# EAGLE design ardunio-physics-board-v4 (EAGLE 9.6.2)
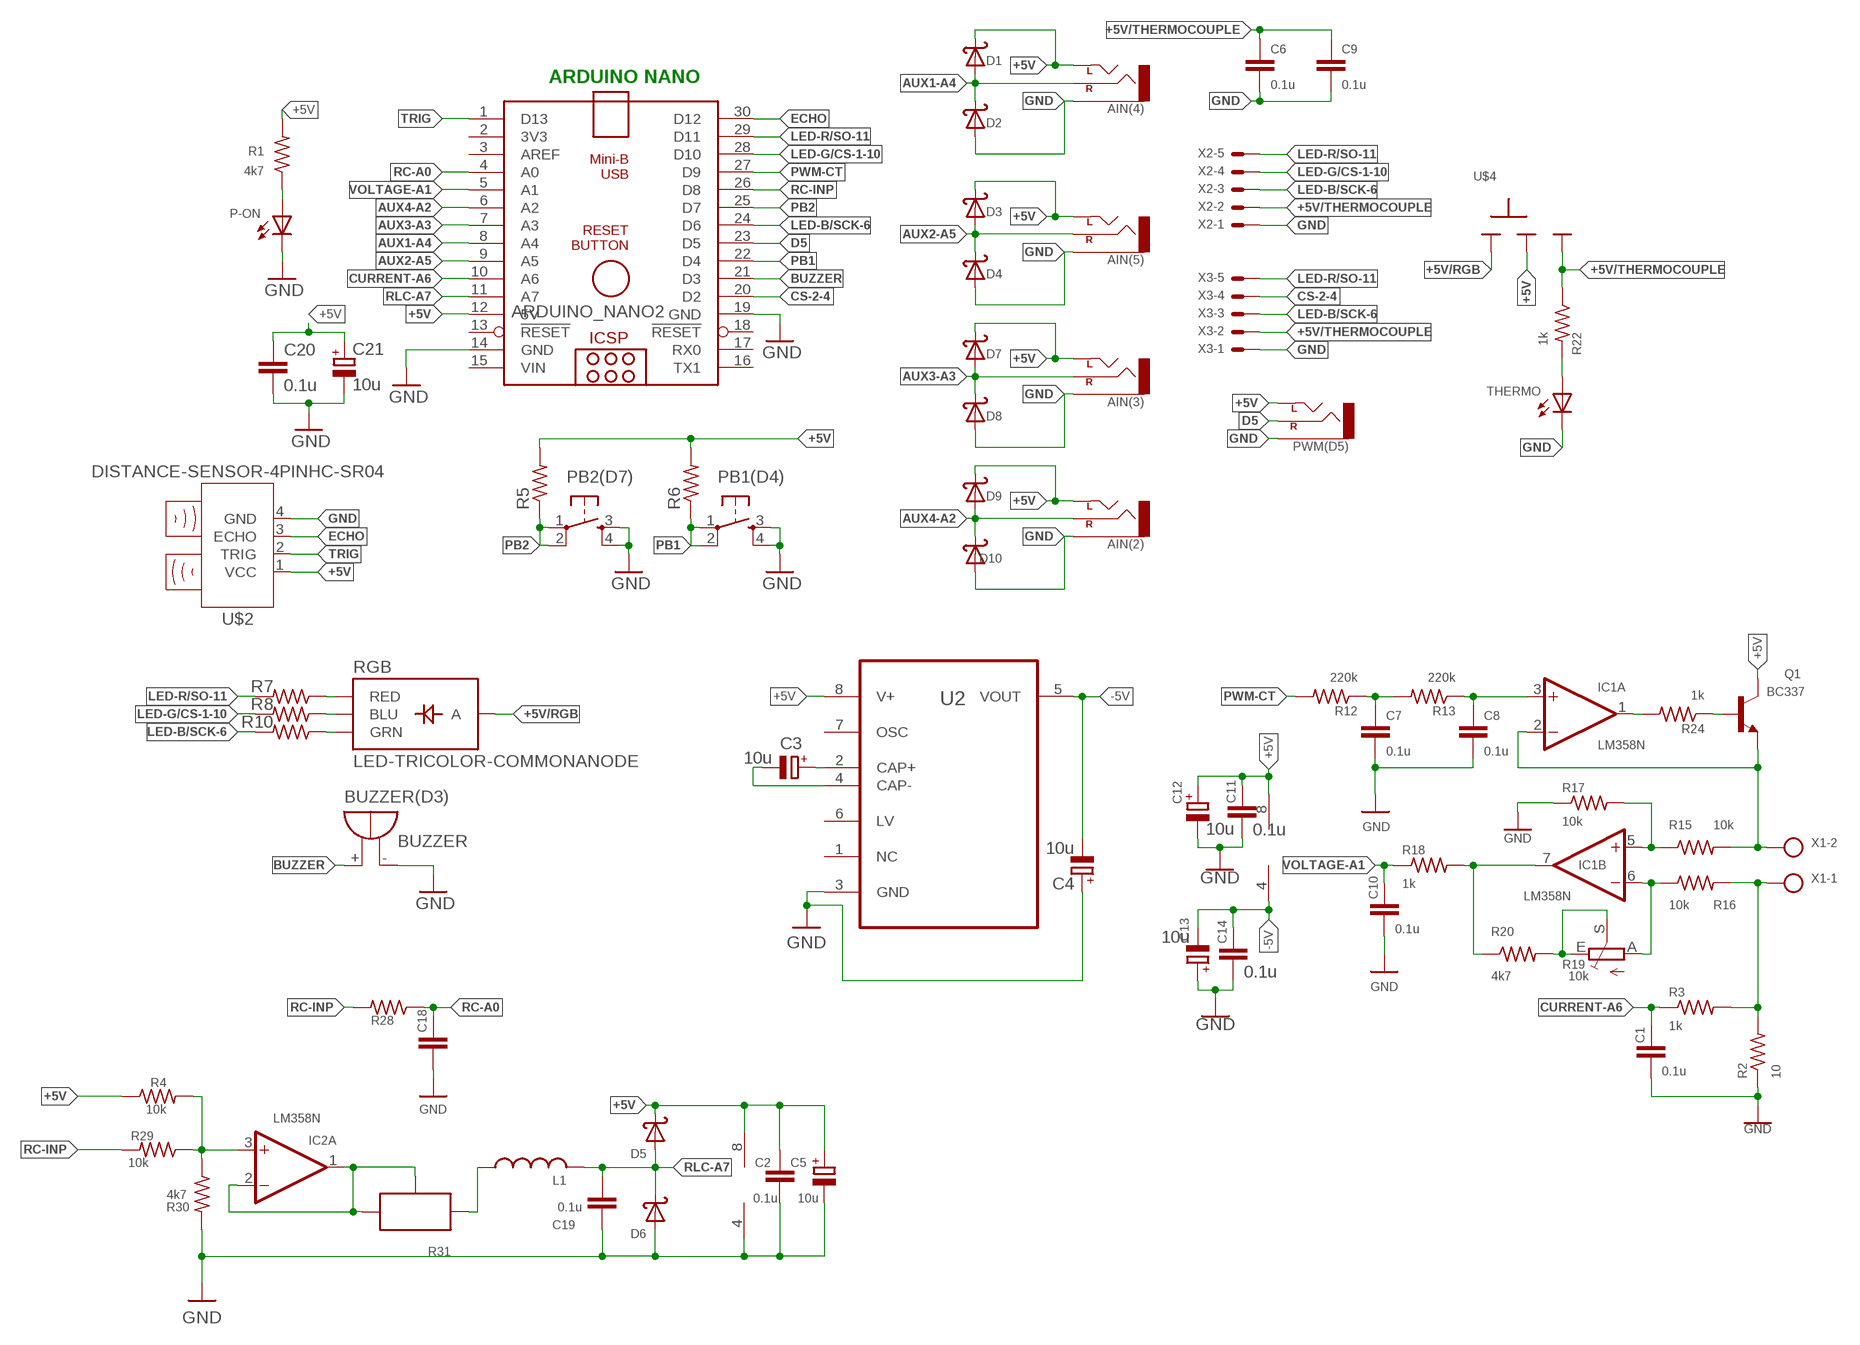
[diagram p0: schematic, sheet 1]

## Parts
AIN(2)  AUX-CONNECTOR_CEDT_JANUARY_2015_V5_AUDIO-JACKPTH  [AUX-CONNECTOR_CEDT_JANUARY_2015_V5_AUDIO-JACK]
AIN(3)  AUX-CONNECTOR_CEDT_JANUARY_2015_V5_AUDIO-JACKPTH  [AUX-CONNECTOR_CEDT_JANUARY_2015_V5_AUDIO-JACK]
AIN(4)  AUX-CONNECTOR_CEDT_JANUARY_2015_V5_AUDIO-JACKPTH  [AUX-CONNECTOR_CEDT_JANUARY_2015_V5_AUDIO-JACK]
AIN(5)  AUX-CONNECTOR_CEDT_JANUARY_2015_V5_AUDIO-JACKPTH  [AUX-CONNECTOR_CEDT_JANUARY_2015_V5_AUDIO-JACK]
ARDUINO_NANO2  ARDUINONANOV30_ARDUINO_NANO  [ARDUINONANOV30_ARDUINO_NANO]
BUZZER(D3)  BUZZER  [F/TMB]
C1  0.1u  C-EU025-025X050  [C025-025X050]
C2  0.1u  C-EU025-025X050  [C025-025X050]
C3  10u  CPOL-EUTT2D5  [TT2D5]
C4  10u  CPOL-EUTT2D5  [TT2D5]
C5  10u  CPOL-EUTT2D5  [TT2D5]
C6  0.1u  C-EU025-024X044  [C025-024X044]
C7  0.1u  C-EU025-025X050  [C025-025X050]
C8  0.1u  C-EU025-025X050  [C025-025X050]
C9  0.1u  C-EU025-024X044  [C025-024X044]
C10  0.1u  C-EU025-025X050  [C025-025X050]
C11  0.1u  C-EU025-025X050  [C025-025X050]
C12  10u  CPOL-EUTT2D5  [TT2D5]
C13  10u  CPOL-EUTT2D5  [TT2D5]
C14  0.1u  C-EU025-025X050  [C025-025X050]
C18  C-EU025-025X050  [C025-025X050]
C19  0.1u  C-EU025-025X050  [C025-025X050]
C20  0.1u  C-EU025-024X044  [C025-024X044]
C21  10u  CPOL-EUE2.5-5  [E2,5-5]
D1  1N5819  [DO41-10]
D2  1N5819  [DO41-10]
D3  1N5819  [DO41-10]
D4  1N5819  [DO41-10]
D5  1N5819  [DO41-10]
D6  1N5819  [DO41-10]
D7  1N5819  [DO41-10]
D8  1N5819  [DO41-10]
D9  1N5819  [DO41-10]
D10  1N5819  [DO41-10]
IC1  LM358N  [DIL08]
IC2  LM358N  [DIL08]
L1  L-US6000-XXX-RC  [6000-XXXX-RC]
P-ON  LED3MM  [LED3MM]
PB1(D4)  OMRON_SWITCH_40-XX  [B3F-40XX]
PB2(D7)  OMRON_SWITCH_40-XX  [B3F-40XX]
PWM(D5)  AUX-CONNECTOR_CEDT_JANUARY_2015_V5_AUDIO-JACKPTH  [AUX-CONNECTOR_CEDT_JANUARY_2015_V5_AUDIO-JACK]
Q1  BC337  [TO92]
R1  4k7  R-US_0204/7  [0204/7]
R2  10  RESISTOR0207/10  [0207/10]
R3  1k  R-US_0204/7  [0204/7]
R4  10k  R-US_0207/10  [0207/10]
R5  R-US_0204/7  [0204/7]
R6  R-US_0204/7  [0204/7]
R7  R-US_0207/10  [0207/10]
R8  R-US_0207/10  [0207/10]
R10  R-US_0207/10  [0207/10]
R12  220k  R-US_0207/10  [0207/10]
R13  220k  R-US_0204/7  [0204/7]
R15  10k  R-US_0204/7  [0204/7]
R16  10k  R-US_0204/7  [0204/7]
R17  10k  R-US_0204/7  [0204/7]
R18  1k  R-US_0204/7  [0204/7]
R19  10k  TRIM_EU-RJ9W  [RJ9W]
R20  4k7  R-US_0204/7  [0204/7]
R22  1k  R-US_0204/7  [0204/7]
R24  1k  R-US_0204/7  [0204/7]
R28  R-US_0207/10  [0207/10]
R29  10k  R-US_0204/7  [0204/7]
R30  4k7  R-US_0207/10  [0207/10]
R31  POTNORMAL  [RJ9W]
RGB  LED-TRICOLOR-COMMONANODE  [LED-TRICOLOR-THROUGHHOLE]
THERMO  LED3MM  [LED3MM]
U2  ICL7660CPAZ_ICL7660CPAZ  [ICL7660CPAZ_DIP254P762X533-8]
U$2  DISTANCE-SENSOR-4PINHC-SR04  [HC-SR04]
U$4  SLIDESWITCH-BIG  [BIGSWITCH]
X1  AK500/2-H  [AK500/2-H]
X2  JST-XH-05-PIN-LONG-PAD  [JST-XH-05-PACKAGE-LONG-PAD]
X3  JST-XH-05-PIN-LONG-PAD  [JST-XH-05-PACKAGE-LONG-PAD]

## Nets
+5V [POWER]: AIN(2).TIP(LEFT) AIN(3).TIP(LEFT) AIN(4).TIP(LEFT) AIN(5).TIP(LEFT) ARDUINO_NANO2.12(5V) C2.1 C5.+ C11.1 C12.+ C20.1 C21.+ D1.C D3.C D5.C D7.C D9.C IC1.8(P:V+) IC2.8(P:V+) PWM(D5).TIP(LEFT) Q1.3(C) R1.2 R4.1 R5.2 R6.2 U2.8(V+) U$2.1(VCC) U$4.2
+5V/RGB: RGB.ANODE(A) U$4.1
+5V/THERMOCOUPLE: C6.1 C9.1 R22.1 U$4.3 X2.2 X3.2
-5V: C4.- C13.- C14.1 IC1.4(P:V-) U2.5(VOUT)
AUX1-A4: AIN(4).RING(RIGHT) ARDUINO_NANO2.8(A4) D1.A D2.C
AUX2-A5: AIN(5).RING(RIGHT) ARDUINO_NANO2.9(A5) D3.A D4.C
AUX3-A3: AIN(3).RING(RIGHT) ARDUINO_NANO2.7(A3) D7.A D8.C
AUX4-A2: AIN(2).RING(RIGHT) ARDUINO_NANO2.6(A2) D9.A D10.C
BUZZER: ARDUINO_NANO2.21(D3) BUZZER(D3).+
CS-2-4: ARDUINO_NANO2.20(D2) X3.4
CURRENT-A6: ARDUINO_NANO2.10(A6) C1.1 R3.1
D5: ARDUINO_NANO2.23(D5) PWM(D5).RING(RIGHT)
ECHO: ARDUINO_NANO2.30(D12) U$2.3(ECHO)
GND [POWER]: AIN(2).SLEEVE AIN(3).SLEEVE AIN(4).SLEEVE AIN(5).SLEEVE ARDUINO_NANO2.14(GND) ARDUINO_NANO2.19(GND) BUZZER(D3).- C1.2 C2.2 C4.+ C5.- C6.2 C7.2 C8.2 C9.2 C10.2 C11.2 C12.- C13.+ C14.2 C18.2 C19.2 C20.2 C21.- D2.A D4.A D6.A D8.A D10.A IC2.4(P:V-) P-ON.K(C) PB1(D4).3(S) PB1(D4).4(S1) PB2(D7).3(S) PB2(D7).4(S1) PWM(D5).SLEEVE R2.1 R17.1 R30.2 THERMO.K(C) U2.3(GND) U$2.4(GND) X2.1 X3.1
LED-B/SCK-6: ARDUINO_NANO2.24(D6) R10.2 X2.3 X3.3
LED-G/CS-1-10: ARDUINO_NANO2.28(D10) R8.2 X2.4
LED-R/SO-11: ARDUINO_NANO2.29(D11) R7.2 X2.5 X3.5
N$1: IC1.2(A:-IN) Q1.1(E) R15.2 X1.2
N$2: R7.1 RGB.RED
N$3: R8.1 RGB.BLU
N$4: R10.1 RGB.GRN
N$5: IC1.1(A:OUT) R24.2
N$6: C8.1 IC1.3(A:+IN) R13.1
N$7: IC2.3(A:+IN) R4.2 R29.1 R30.1
N$9: C3.+ U2.2(CAP+)
N$10: C3.- U2.4(CAP-)
N$11: C7.1 R12.1 R13.2
N$12: R2.2 R3.2 R16.2 X1.1
N$13: P-ON.A R1.1
N$14: Q1.2(B) R24.1
N$15: IC2.1(A:OUT) IC2.2(A:-IN) R31.A R31.S
N$17: IC1.5(B:+IN) R15.1 R17.2
N$18: IC1.6(B:-IN) R16.1 R19.A
N$20: R19.E R19.S R20.2
N$21: IC1.7(B:OUT) R18.2 R20.1
N$27: R22.2 THERMO.A
N$28: L1.1 R31.E
PB1: ARDUINO_NANO2.22(D4) PB1(D4).1(P) PB1(D4).2(P1) R6.1
PB2: ARDUINO_NANO2.25(D7) PB2(D7).1(P) PB2(D7).2(P1) R5.1
PWM-CT: ARDUINO_NANO2.27(D9) R12.2
RC-A0: ARDUINO_NANO2.4(A0) C18.1 R28.1
RC-INP: ARDUINO_NANO2.26(D8) R28.2 R29.2
RLC-A7: ARDUINO_NANO2.11(A7) C19.1 D5.A D6.C L1.2
TRIG: ARDUINO_NANO2.1(D13) U$2.2(TRIG)
VOLTAGE-A1: ARDUINO_NANO2.5(A1) C10.1 R18.1
Unconnected: ARDUINO_NANO2.2(3V3) ARDUINO_NANO2.3(AREF) ARDUINO_NANO2.13(!RESET) ARDUINO_NANO2.16(TX1) ARDUINO_NANO2.17(RX0) ARDUINO_NANO2.18(!RESET) IC2.5(B:+IN) IC2.6(B:-IN) IC2.7(B:OUT) U2.1(NC) U2.6(LV) U2.7(OSC)

## Notes on the sheet
- ARDUINO NANO

## Power pins joined to a net without a drawn wire
VIN: ARDUINO_NANO2.15(VIN)

## Library data of the parts
AIN(2) AIN(3) AIN(4) AIN(5) PWM(D5) = aux-connector:AUX-CONNECTOR_CEDT_JANUARY_2015_V5_AUDIO-JACK: 3.5mm Audio Jack Simple 3.5mm common PCB mount audio jack. SKU: PRT-08032
ARDUINO_NANO2 = nano:ARDUINONANOV30_ARDUINO_NANO: Arduino Nano V3.0 Overview: The Arduino Nano is a small, complete, and breadboard-friendly board based on the ATmega328 (Arduino Nano 3.x) or ATmega168 (Arduino Nano 2.x). It has more or less the same functionality of the Arduino Duemilanove, but in a different package. It lacks only a DC power jack, and works with a Mini-B USB cable instead of a standard one. The Nano was designed and is being produced by Gravitech. Specifications: Microcontroller Atmel ATmega168 or ATmega328 Operating Voltage (logic level) 5 V Input Voltage (recommended) 7-12 V Input Voltage (limits) 6-20 V Digital I/O Pins 14 (of which 6 provide PWM output) Analog Input Pins 8 DC Current per I/O Pin 40 mA Flash Memory 16 KB (ATmega168) or 32 KB (ATmega328) of which 2 KB used by bootloader SRAM 1 KB (ATmega168) or 2 KB (ATmega328) EEPROM 512 bytes (ATmega168) or 1 KB (ATmega328) Clock Speed 16 MHz Dimensions 0.73" x 1.70" Length 45 mm Width 18 mm Weigth 5 g Power: The Arduino Nano can be powered via the Mini-B USB connection, 6-20V unregulated external power supply (pin 30), or 5V regulated external power supply (pin 27). The power source is automatically selected to the highest voltage source. Memory: The ATmega168 has 16 KB of flash memory for storing code (of which 2 KB is used for the bootloader); the ATmega328 has 32 KB, (also with 2 KB used for the bootloader). The ATmega168 has 1 KB of SRAM and 512 bytes of EEPROM (which can be read and written with the EEPROM library); the ATmega328 has 2 KB of SRAM and 1 KB of EEPROM. Input and Output: Each of the 14 digital pins on the Nano can be used as an input or output, using pinMode(), digitalWrite(), and digitalRead() functions. They operate at 5 volts. Each pin can provide or receive a maximum of 40 mA and has an internal pull-up resistor (disconnected by default) of 20-50 kOhms. In addition, some pins have specialized functions. Visit Arduino - ArduinoBoardNano <https://www.arduino.cc/en/Main/ArduinoBoardNano>
BUZZER(D3) = CEDT_JANUARY_2015_v5:BUZZER: BUZZER Source: Buerklin; OC_FARNELL: unknown; OC_NEWARK: unknown
C1 C2 C6-C11 C14 C18-C20 = rcl:C-EU: CAPACITOR, European symbol; SPICEPREFIX: C
C3-C5 C12 C13 C21 = rcl:CPOL-EU: POLARIZED CAPACITOR, European symbol; SPICEPREFIX: C
D1-D10 = CEDT_JANUARY_2015_v5:1N5819: DIODE general purpose rectifier, 1 A
IC1 IC2 = CEDT_JANUARY_2015_v5:LM358: OP AMP also LM158; LM258; LM2904 Source: http://cache.national.com/ds/LM/LM158.pdf
L1 = rcl:L-US: INDUCTOR, American symbol; SPICEPREFIX: L
P-ON THERMO = CEDT:LED; OC_FARNELL: unknown
PB1(D4) PB2(D7) = CEDT_JANUARY_2015_v5:OMRON_SWITCH
Q1 = transistor-npn:BC337*: NPN Transistor
R1 R3-R8 R10 R12 R13 R15-R18 R20 R22 R24 R28-R30 = rcl:R-US_: RESISTOR, American symbol; SPICEPREFIX: R
R2 = CEDT_JANUARY_2015_v5:RESISTOR
R19 = pot:TRIM_EU-: POTENTIOMETER
R31 = CEDT_JANUARY_2015_v5:POT
RGB = CEDT_JANUARY_2015_v5:LED-TRICOLOR-COMMONANODE
U2 = CurveTracer_V6:ICL7660CPAZ_ICL7660CPAZ: CMOS Voltage Converters Check prices <https://pricing.snapeda.com/parts/ICL7660CPAZ/Renesas%20Electronics/view-part?ref=eda>; AVAILABILITY: In Stock; DESCRIPTION: Charge Pump Switching Regulator IC Positive or Negative Fixed -Vin, 2Vin 1 Output 45mA 8-DIP (0.300, 7.62mm); MF: Renesas Electronics; MP: ICL7660CPAZ; PACKAGE: DIP-8 Intersil; PRICE: None
U$2 = Tinkercad:DISTANCE-SENSOR-4PIN
U$4 = CEDT_JANUARY_2015_v5:SLIDESWITCH
X1 = con-ptr500:AK500/2-H: CONNECTOR Aug. 2004 / PTR Meßtechnik: Die Bezeichnung der Serie AK505 wurde geändert. Es handelt sich hierbei um AK500 in horizontaler Ausführung.; OC_FARNELL: unknown; OC_NEWARK: unknown
X2 X3 = Rembrandt Electronics - JST XH Connectors v1-0:JST-XH-05-PIN: JST XH Connector 2 Pin Wire to board connector. Pitch: 2,54 mm, (0.100") Number of pins: 5 Created by Rembrandt Electronics www.rembrandtelectronics.com

## Net classes
0 default: width 0.813 mm
1 POWER: width 1.016 mm

## Board
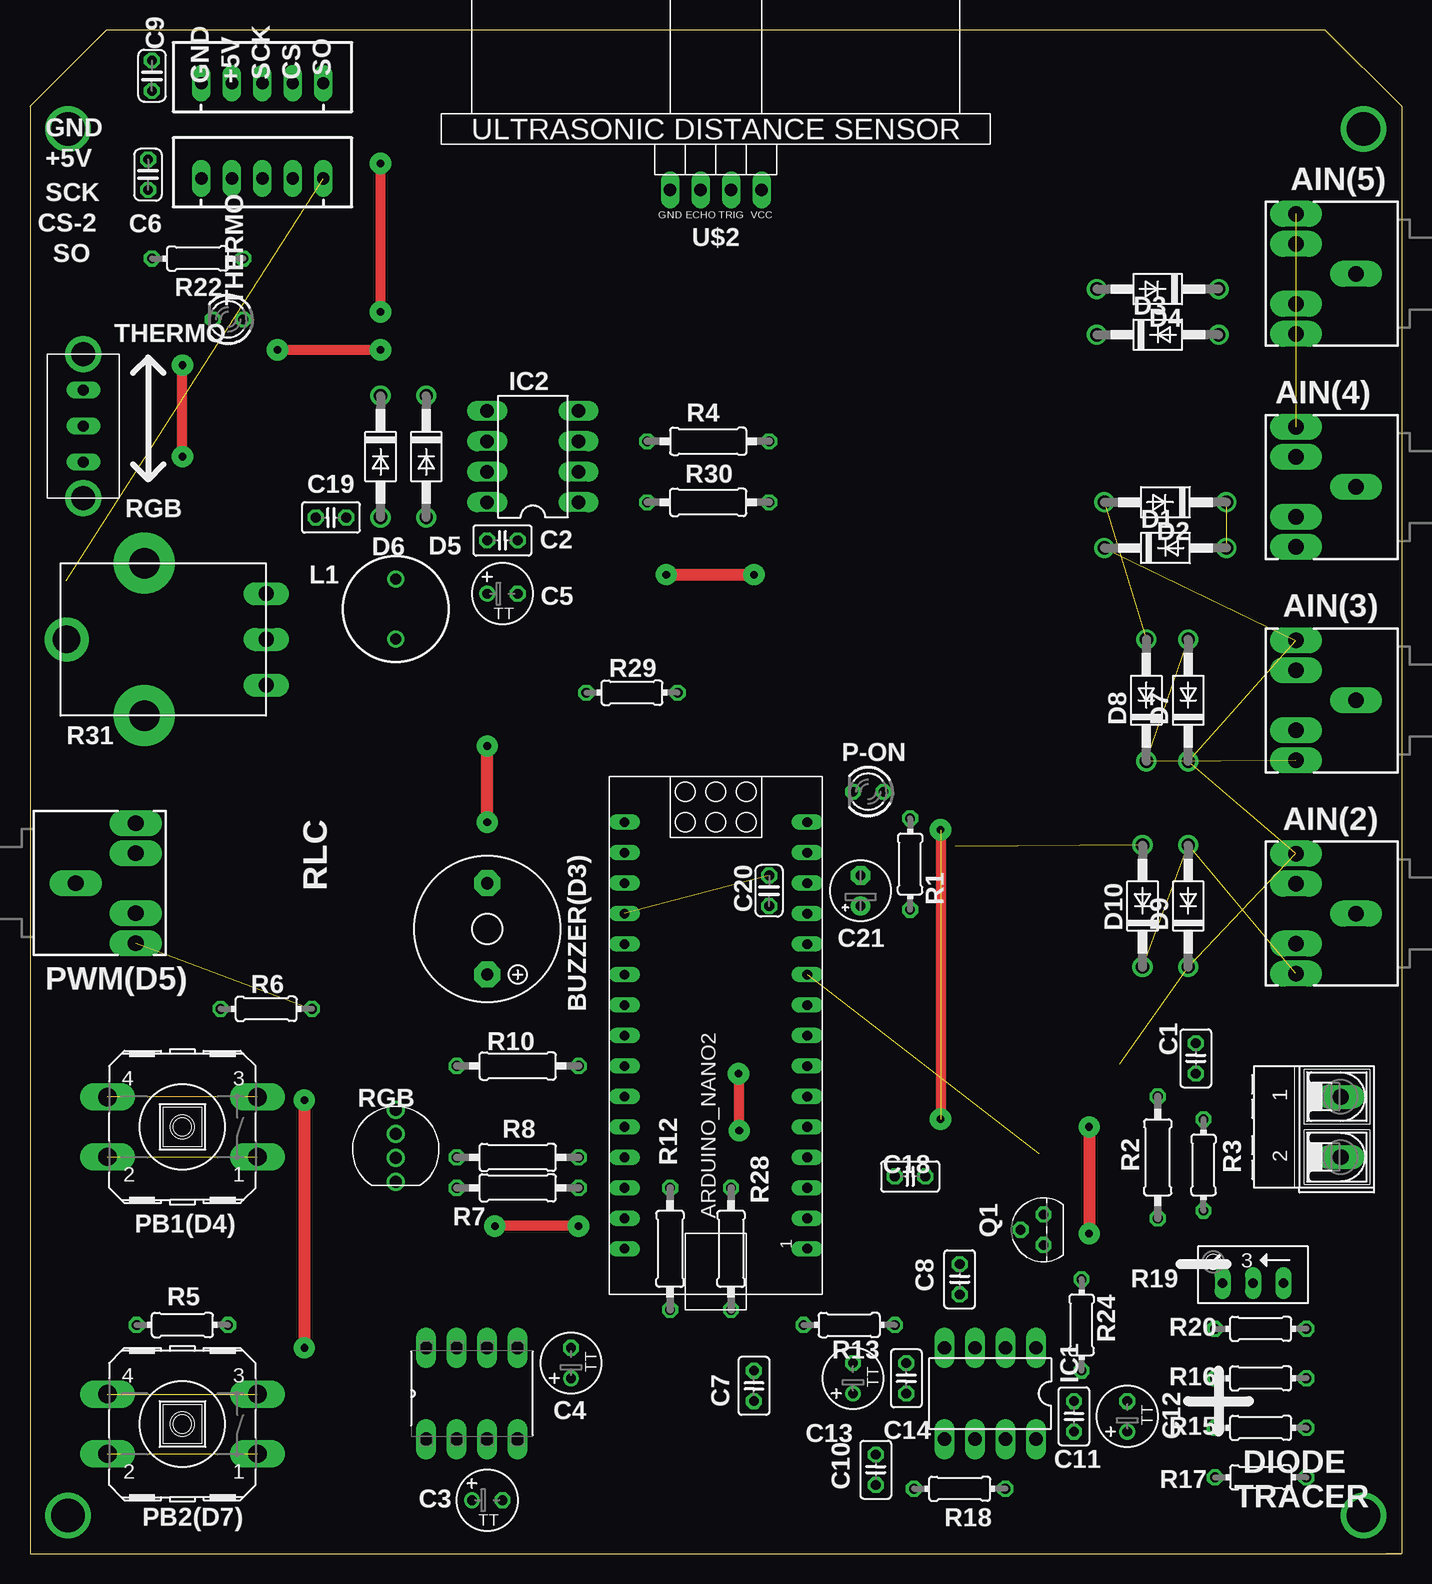
[diagram p1: board, top side]
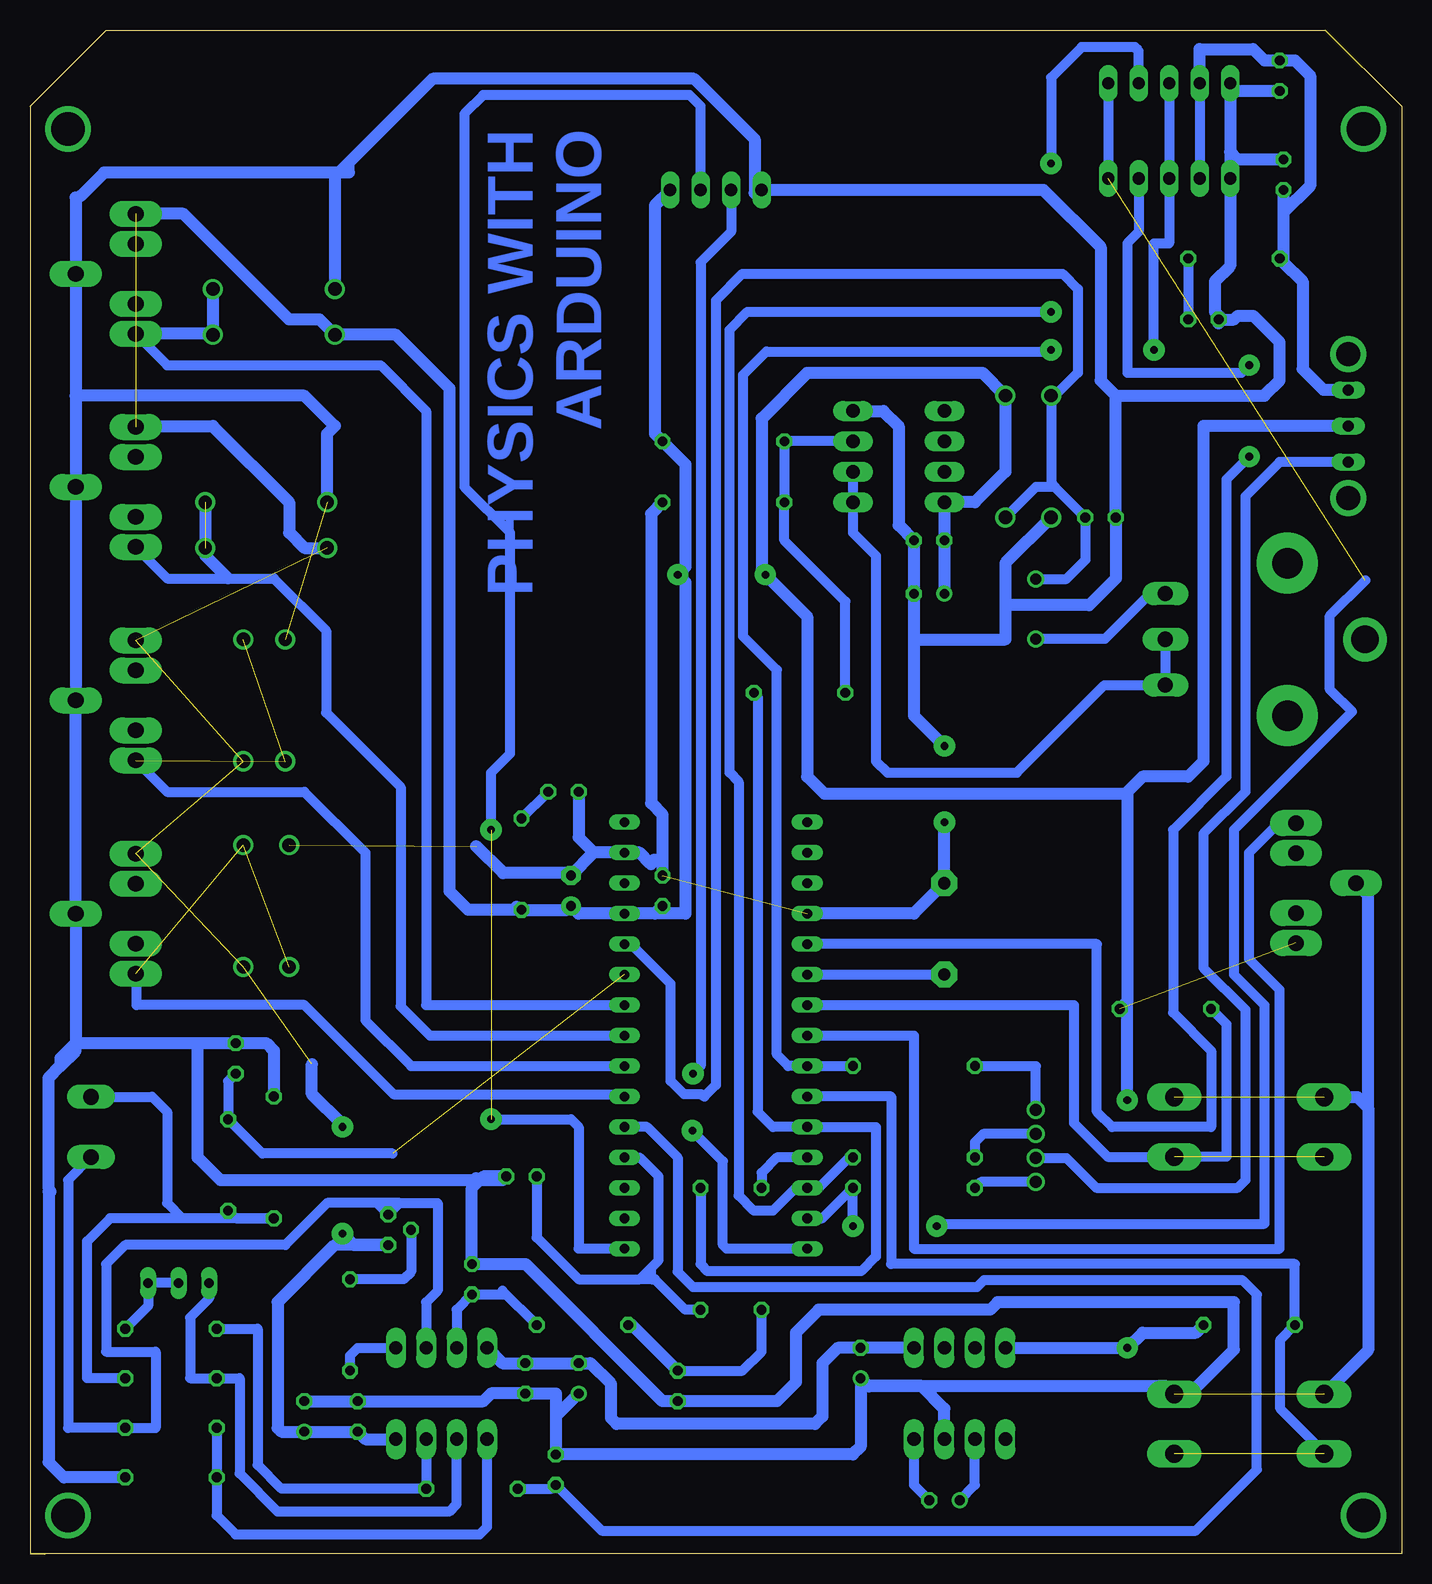
[diagram p2: board, bottom side, seen from below]

Size 114.3 x 127 mm. Coordinates in mm from the lower left corner, seen from the top.
Outline: 113.03,0 0,0 0,120.65 6.35,127 107.95,127 114.3,120.65 114.3,0 113.03,0
Outline: 113.03,0 114.28,0
Copper layers (1*16): Top 0.035mm / dielectric 1.5mm / Bottom 0.035mm
Design rules "default *": minimum track width 6mil, minimum drill 0.35mm, track to track 12mil, track to pad 12mil, pad to pad 12mil, via to via 12mil, smd to smd 12mil, copper to edge 40mil, drill to drill 6mil, minimum pad ring 10mil, minimum via ring 8mil, stop-mask expansion 4mil, vias tented up to drill 0mil, thermal gap 10mil

### Footprints (pad centres in the part's own frame; a part is rotated, then mirrored left to right if it is on the bottom)
AUX-CONNECTOR_CEDT_JANUARY_2015_V5_AUDIO-JACK = drill 1.3 pad 2.184 long: RING 5,5; RSH 5,2.5; SLEEVE 0,0; TIP 5,-5; TSH 5,-2.5
ARDUINONANOV30_ARDUINO_NANO = drill 0.8 long: 1 16.51,3.81; 2 16.51,6.35; 3 16.51,8.89; 4 16.51,11.43; 5 16.51,13.97; 6 16.51,16.51; 7 16.51,19.05; 8 16.51,21.59; 9 16.51,24.13; 10 16.51,26.67; 11 16.51,29.21; 12 16.51,31.75; 13 16.51,34.29; 14 16.51,36.83; 15 16.51,39.37; 16 1.27,39.37; 17 1.27,36.83; 18 1.27,34.29; 19 1.27,31.75; 20 1.27,29.21; 21 1.27,26.67; 22 1.27,24.13; 23 1.27,21.59; 24 1.27,19.05; 25 1.27,16.51; 26 1.27,13.97; 27 1.27,11.43; 28 1.27,8.89; 29 1.27,6.35; 30 1.27,3.81
F/TMB = drill 1.016 pad 2.159 octagon: + 3.81,0; - -3.81,0
C025-025X050 = drill 0.813 octagon: 1 -1.27,0; 2 1.27,0
TT2D5 = drill 0.813: + -1.27,0 | drill 0.813 octagon: - 1.27,0
C025-024X044 = drill 0.813 octagon: 1 -1.27,0; 2 1.27,0
E2,5-5 = drill 0.813 pad 1.6: + -1.27,0 | drill 0.813 pad 1.6 octagon: - 1.27,0
DO41-10 = drill 1.118: A 5.08,0; C -5.08,0
DIL08 = drill 1.118 long: 1 -3.81,-3.81; 2 -1.27,-3.81; 3 1.27,-3.81; 4 3.81,-3.81; 5 3.81,3.81; 6 1.27,3.81; 7 -1.27,3.81; 8 -3.81,3.81
6000-XXXX-RC = drill 0.9 pad 1.422: 1 -2.5,0; 2 2.5,0
LED3MM = drill 0.813 octagon: A -1.27,0; K 1.27,0
B3F-40XX = drill 1.524 long: 1 -6.248,2.489; 2 6.248,2.489; 3 -6.248,-2.489; 4 6.248,-2.489
TO92 = drill 0.813 octagon: 1 1.27,0; 2 0,1.905; 3 -1.27,0
0204/7 = drill 0.813 octagon: 1 -3.81,0; 2 3.81,0
0207/10 = drill 0.813 octagon: 1 -5.08,0; 2 5.08,0
RJ9W = drill 0.813 long: A 2.54,0.635; E -2.54,0.635; S 0,0.635
RJ9W' = drill 1.27 long: A 3.81,8.255; E -3.81,8.255; S 0,8.255 | drill 2.286 pad 3.658: P$1 0,-8.382 | drill 2.54 pad 5.08: P$3 6.35,-1.905; P$4 -6.35,-1.905
LED-TRICOLOR-THROUGHHOLE = drill 1: ANODE -1,0; BLU 1,0; GRN 3,0; RED -3,0
ICL7660CPAZ_DIP254P762X533-8 = drill 1.118 long: 1 -7.62,7.62; 2 -7.62,5.08; 3 -7.62,2.54; 4 -7.62,0; 5 0,0; 6 0,2.54; 7 0,5.08; 8 0,7.62
HC-SR04 = drill 1.016 long: 1 -3.81,0; 2 -1.27,0; 3 1.27,0; 4 3.81,0
BIGSWITCH = drill 0.9 long: 1 -3,0; 2 0,0; 3 3,0 | drill 2 pad 2.184: TAB1 -6,0; TAB2 6,0
AK500/2-H = drill 1.321 long: 1 -2.515,0; 2 2.515,0
JST-XH-05-PACKAGE-LONG-PAD = drill 1.016 long: 1 -5.08,0; 2 -2.54,0; 3 0,0; 4 2.54,0; 5 5.08,0

### Placement (x,y rotation side)
AIN(2)  110.49,53.34 180 top
AIN(3)  110.49,71.12 180 top
AIN(4)  110.49,88.9 180 top
AIN(5)  110.49,106.68 180 top
ARDUINO_NANO2  48.26,21.59 0 top
BUZZER(D3)  38.1,52.07 270 top
C1  97.16,41.27 90 top
C2  39.37,84.45 0 top
C3  38.1,4.45 0 top
C4  45.09,15.88 90 top
C5  39.37,80.01 0 top
C6  9.84,114.94 90 top
C7  60.33,13.97 270 top
C8  77.47,22.86 90 top
C9  10.16,123.19 270 top
C10  70.48,6.99 90 top
C11  87,11.43 90 top
C12  91.44,11.43 90 top
C13  68.58,14.61 90 top
C14  73.03,14.61 270 top
C18  73.34,31.43 0 top
C19  25.08,86.36 180 top
C20  61.59,55.24 90 top
C21  69.22,55.24 90 top
D1  94.61,83.82 0 top
D2  94.61,87.63 180 top
D3  93.98,101.6 0 top
D4  93.98,105.41 180 top
D5  33.02,91.44 270 top
D6  29.21,91.44 270 top
D7  96.52,71.12 90 top
D8  93.03,71.12 90 top
D9  96.52,53.98 90 top
D10  92.71,53.98 90 top
IC1  80.01,13.34 180 top
IC2  41.91,91.44 90 top
L1  30.48,78.74 90 top
P-ON  69.85,63.5 180 top
PB1(D4)  12.7,35.56 180 top
PB2(D7)  12.7,10.79 180 top
PWM(D5)  3.81,55.88 0 top
Q1  84.45,26.99 90 top
R1  73.34,57.47 270 top
R2  93.98,33.02 270 top
R3  97.79,32.38 270 top
R4  56.52,92.71 180 top
R5  12.7,19.05 0 top
R6  19.68,45.4 0 top
R7  40.64,30.48 0 top
R8  40.64,33.02 0 top
R10  40.64,40.64 0 top
R12  53.34,25.4 90 top
R13  68.26,19.05 180 top
R15  102.55,10.48 0 top
R16  102.55,14.61 0 top
R17  102.55,6.35 180 top
R18  77.47,5.4 0 top
R19  101.92,23.18 180 top
R20  102.55,18.73 0 top
R22  13.97,107.95 0 top
R24  87.63,19.05 270 top
R28  58.42,25.4 90 top
R29  50.16,71.75 0 top
R30  56.52,87.63 0 top
R31  [RJ9W']  11.43,76.2 270 top
RGB  30.48,33.97 90 top
THERMO  16.51,102.87 180 top
U2  40.64,17.14 90 top
U$2  57.15,113.67 180 top
U$4  4.45,93.98 90 top
X1  109.22,35.56 270 top
X2  19.37,122.56 0 top
X3  19.37,114.62 0 top

### Tracks (layer width: path | path; a pad name or v marks a point on that pad's centre or on a via)
+5V  (via drill 0.64 pad 1.78)  (7 unrouted)
  Top 1.016: v88.27,35.56 v88.27,26.67 | v22.86,37.78 v22.86,17.14 | v53.02,81.6 v60.33,81.6
  Bottom 1.016: C20.1 62.23,53.34 | IC1.8 86.36,9.53 C11.1 C12.+ 93.34,10.16 93.66,10.48 93.66,20.95 88.9,25.72 Q1.3 87.31,25.72 v88.27,26.67 | 62.23,53.34 59.69,53.34 59.69,80.96 v60.33,81.6 59.69,82.23 59.69,90.81 R4.1 62.23,93.34 62.23,112.39 U$2.1 | C5.+ C2.1 IC2.8 35.56,87.63 33.02,90.17 D5.C 34.92,98.42 49.53,98.42 53.34,94.61 53.34,81.92 v53.02,81.6 49.53,78.11 49.53,64.77 48.09,63.34 22.86,63.34 | R1.2 69.53,53.66 C21.+ 68.58,53.34 ARDUINO_NANO2.12 62.23,53.34 | R5.2 17.14,18.41 21.59,18.41 v22.86,17.14 U2.8 | 22.86,63.34 22.86,63.5 21.59,64.77 17.78,64.77 16.51,66.04 16.51,93.98 U$4.2 | 22.86,63.34 22.86,46.04 | v22.86,37.78 22.86,46.04 | R6.2 22.86,46.04 | 90.81,40.79 90.81,38.28 88.29,35.76 v88.27,35.56 | 73.76,53.92 R1.2 | AIN(5).TIP 101.52,111.68 92.71,102.87 90.17,102.87 D3.C 83.82,101.6 79.32,97.1 79.32,55.19 77.79,53.66 R1.2 | AIN(4).TIP 105.41,93.98 99.06,93.98 92.71,87.63 92.71,85.09 91.44,83.82 D1.C
+5V/RGB
  Bottom 0.813: RGB.ANODE 27.94,32.97 25.45,30.48 13.65,30.48 13.02,31.11 13.02,45.34 16.51,48.83 16.51,60.01 13.02,63.5 13.02,88.12 10.16,90.98 U$4.1
+5V/THERMOCOUPLE
  Bottom 0.813: X2.2 X3.2
  Bottom 1.016: R22.1 9.84,107.63 | 9.84,107.63 8.26,106.05 8.26,98.74 6.49,96.98 U$4.3 | X2.2 16.83,125.41 12.38,125.41 11.43,124.46 C9.1 8.89,124.46 7.62,123.19 7.62,113.98 9.84,111.76 | C6.1 9.84,111.76 | 9.84,111.76 9.84,107.63
-5V
  Bottom 1.016: IC1.4 74.93,15.88 C14.1 C13.- 67.63,15.88 65.88,14.13 65.88,11.27 65.41,10.79 48.9,10.79 48.26,11.43 48.26,15.88 46.99,17.14 C4.- U2.5
AUX1-A4  (1 unrouted)
  Bottom 0.813: AIN(4).RING 102.87,81.28 97.79,81.28 93.98,81.28 89.62,76.92 89.62,70.09 83.41,63.88 83.41,45.62 80.97,43.18 ARDUINO_NANO2.8
  Bottom 1.016: D2.C 99.69,83.19 97.79,81.28
AUX2-A5
  Bottom 0.813: AIN(5).RING 102.87,99.06 85.09,99.06 81.28,95.25 81.28,45.72 ARDUINO_NANO2.9
  Bottom 1.016: D4.C D3.A 99.14,101.68 AIN(5).RING
AUX3-A3  (2 unrouted)
  Bottom 0.813: AIN(3).RING 102.87,63.5 91.44,63.5 86.36,58.42 86.36,44.45 82.55,40.64 ARDUINO_NANO2.7
AUX4-A2  (2 unrouted)
  Bottom 0.813: ARDUINO_NANO2.6 64.82,38.28 84,38.28 91.44,45.72 105.41,45.72 105.41,48.26 AIN(2).RING
BUZZER
  Bottom 0.813: ARDUINO_NANO2.21 BUZZER(D3).+
CS-2-4  (via drill 0.64 pad 1.78)
  Top 0.813: v12.7,91.44 v12.7,99.06
  Bottom 0.813: v12.7,91.44 14.61,89.53 14.61,64.77 19.05,60.33 19.05,45.09 15.88,41.91 15.88,35.56 24.13,35.56 25.4,36.83 25.4,50.8 ARDUINO_NANO2.20 | v12.7,99.06 13.34,98.42 22.86,98.42 22.86,109.22 21.91,110.17 X3.4
CURRENT-A6  (1 unrouted)
  Bottom 0.813: C1.1 97.79,39.37 R3.1 94.93,33.34 84.07,33.34 | 64.82,48.34 ARDUINO_NANO2.10
D5
  Bottom 0.813: ARDUINO_NANO2.23 40.64,43.18 40.64,25.4 10.16,25.4 10.16,46.99 12.7,49.53 12.7,58.42 10.24,60.88 PWM(D5).RING
ECHO  (via drill 0.64 pad 1.78)
  Top 0.813: v59.11,35.24 59.11,39.95 v59.05,40.01
  Bottom 0.813: U$2.3 55.88,110.17 58.42,107.63 58.42,40.64 v59.05,40.01 | v59.11,35.24 56.57,32.7 56.57,25.72 56.25,25.4 ARDUINO_NANO2.30
GND  (via drill 0.64 pad 1.78)  (5 unrouted)
  Top 1.016: v38.1,60.96 v38.1,67.31
  Bottom 1.016: 62.55,57.47 62.61,57.53 | 62.61,57.53 63.5,58.42 ARDUINO_NANO2.14 67.31,58.42 | 67.31,58.42 68.58,59.69 P-ON.K | 67.31,58.42 C21.- 69.57,56.72 74.88,56.72 77.11,58.95 | C12.- C11.2 76.52,12.7 75.88,13.34 C14.2 70.48,13.34 70.48,11.43 | U2.3 38.1,12.06 40.01,13.97 44.45,13.97 | 44.45,13.97 C4.+ 45.09,8.89 45.72,8.26 C10.2 70.48,11.43 | R17.1 111.49,6.35 112.76,7.62 112.76,30.18 | C13.+ 70.48,11.43 | 2.79,37.15 2.79,16.94 PB2(D7).4 | R30.2 62.55,86.68 62.55,62.55 61.59,61.59 61.59,57.84 | 61.59,57.84 C20.2 | IC2.4 43.18,95.25 41.91,93.98 41.91,85.72 C2.2 C5.- 40.64,76.2 | D6.A 33.02,82.55 33.02,79.06 | 33.02,79.06 33.02,76.2 40.64,76.2 | 40.64,76.2 40.64,69.85 v38.1,67.31 39.37,68.58 | 112.76,30.48 112.76,30.18 | PB1(D4).4 3.7,38.05 2.79,37.15 | 23.81,96.52 25.08,97.79 25.08,108.9 29.84,113.67 U$2.4 53.37,113.44 53.65,113.16 53.92,113.44 53.92,117.91 58.95,122.94 80.75,122.94 87.73,115.95 | v38.1,60.96 BUZZER(D3).- 40.64,53.34 ARDUINO_NANO2.19 | R2.1 93.98,41.91 94.61,42.55 C1.2 100.33,42.55 | C18.2 76.52,31.43 76.89,31.06 | 76.89,31.06 77.47,30.48 C8.2 73.03,24.13 61.59,12.7 C7.2 52.07,12.7 50.48,14.29 50.48,18.41 48.58,20.32 34.29,20.32 33.66,20.95 13.97,20.95 13.97,16.99 17.68,13.28 PB2(D7).3 19.58,13.92 44.4,13.92 44.45,13.97 | C9.2 14.29,121.92 X2.1 14.29,116.84 | 14.29,116.84 X3.1 14.29,107.31 15.56,106.05 15.56,103.5 15.08,103.03 THERMO.K | C6.2 13.65,116.2 14.29,116.84 | 110.49,42.55 100.33,42.55 | 112.76,30.48 112.76,39.64 111.76,40.64 | 74.93,31.11 77.11,31.11 | 77.11,31.11 98.42,31.11 100.33,33.02 100.33,42.55 | 110.49,42.55 110.49,41.91 111.76,40.64 | THERMO.K 15.24,102.55
  Bottom 1.016: 23.81,96.52 C19.2 23.81,81.28 26.04,79.06 33.02,79.06 | 23.81,96.52 11.43,96.52 10.16,97.79 10.16,100.97 12.38,103.19 13.65,103.19 13.97,102.87 THERMO.K | 2.79,37.15 2.79,54.86 PWM(D5).SLEEVE | 110.49,96.52 AIN(5).SLEEVE 110.49,113.03 110.08,113.16 108.13,115.11 87.73,115.11 87.73,115.95 | 110.49,96.52 AIN(4).SLEEVE | AIN(4).SLEEVE 110.49,88.85 | 110.49,88.85 AIN(3).SLEEVE AIN(2).SLEEVE 110.49,42.55 | 110.49,42.55 111.76,41.27 111.76,40.64 | 62.61,57.53 62.31,57.84 61.59,57.84 | AIN(4).SLEEVE 110.64,88.85 110.49,88.85 | 77.11,31.11 77.11,31.29 76.89,31.06 | 112.76,30.18 112.6,30.18 112.76,30.48 | 87.73,115.95 88.9,114.78 D4.A | D2.A 89.53,93.34 88.9,93.98 91.44,96.52 110.49,96.52
LED-B/SCK-6  (via drill 0.64 pad 1.78)
  Top 0.813: v29.21,100.33 v20.64,100.33
  Bottom 0.813: X2.3 19.37,114.83 | 19.37,114.83 X3.3 | X3.3 19.37,109.22 20.64,109.22 v20.64,100.33 | v29.21,100.33 29.34,100.2 52.93,100.2 54.86,98.27 54.86,76.45 52.07,73.66 52.07,41.59 51.12,40.64 ARDUINO_NANO2.24 R10.2 | X3.3 19.56,114.83 19.37,114.83
LED-G/CS-1-10  (via drill 0.64 pad 1.78)
  Top 0.813: v29.21,103.5 v29.21,115.89
  Bottom 0.813: v29.21,103.5 54.51,103.5 56.01,102.01 56.01,65.09 55.24,64.33 55.24,29.84 53.98,28.57 52.39,28.57 50.48,30.48 ARDUINO_NANO2.28 48.58,30.48 46.04,33.02 R8.2 | X2.4 21.91,125.26 22.23,125.58 26.67,125.58 29.21,123.04 v29.21,115.89
LED-R/SO-11  (via drill 0.64 pad 1.78)  (1 unrouted)
  Top 0.813: v45.72,27.3 v38.73,27.3
  Bottom 0.813: v38.73,27.3 38.54,27.5 11.43,27.5 11.43,45.72 13.97,48.26 13.97,60.33 4.13,70.17 5.97,72.01 5.97,78.17 3.02,81.12 | v45.72,27.3 R7.2 48.26,27.94 ARDUINO_NANO2.29 | X2.5 X3.5
N$1
  Bottom 0.813: X1.2 111.12,31.14 111.12,10.48 R15.2 103.82,10.48 103.82,16.83 107.95,16.83 107.95,24.13 106.36,25.72 93.03,25.72 89.53,29.21 85.41,29.21 | 85.41,29.21 Q1.1 83.5,29.21 | 83.5,29.21 85.41,29.21 | 83.5,29.21 80.33,29.21 80.33,21.91 81.28,20.95 IC1.2
N$2
  Bottom 0.813: RGB.RED 35.07,30.97 R7.1
N$3
  Bottom 0.813: RGB.BLU 34.88,34.97 35.56,34.29 R8.1
N$4
  Bottom 0.813: R10.1 30.48,40.64 RGB.GRN
N$5
  Bottom 0.813: IC1.1 87,17.14 87.63,16.51 R24.2
N$6
  Bottom 0.813: R13.1 74.93,21.91 74.93,21.59 C8.1 78.74,20.32 IC1.3
N$7
  Bottom 0.813: IC2.3 R4.2 R30.1 51.44,84.45 46.35,79.38 R29.1
N$8  (via drill 2.79 pad 3.81)
  other vias: 111.12,118.75
N$9
  Bottom 0.813: C3.+ 35.56,5.71 U2.2
N$10
  Bottom 0.813: U2.4 40.64,5.71 C3.-
N$11
  Bottom 0.813: C7.1 54.93,15.24 53.34,16.83 R12.1
  Bottom 1.016: R13.2 64.14,19.05 C7.1
N$12
  Bottom 0.813: 108.56,38.08 X1.1 104.11,38.08 102.87,36.83 102.87,29.21 101.6,27.94 | R3.2 97.16,27.94 R2.2 101.6,27.94 | R16.2 109.54,14.61 109.54,26.04 107.63,27.94 101.6,27.94
N$13
  Bottom 0.813: R1.1 P-ON.A
N$14
  Bottom 0.813: Q1.2 82.55,23.5 83.19,22.86 R24.1
N$15
  Bottom 0.813: IC2.2 IC2.1 45.72,85.09 43.81,83.19 43.81,66.04 42.86,65.09 32.07,65.09 24.77,72.39 R31.A R31.S
N$17
  Bottom 0.813: R15.1 R17.2 98.74,3.17 97.16,1.59 76.83,1.59 76.2,2.22 IC1.5
N$18
  Bottom 0.813: R19.A 99.38,21.27 100.97,19.68 100.97,14.61 R16.1 96.84,14.61 96.84,6.67 93.66,3.49 79.38,3.49 78.74,4.13 IC1.6
N$19  (via drill 2.79 pad 3.81)
  other vias: 3.17,118.75
N$20
  Bottom 0.813: R19.S R19.E 104.46,20.64 R20.2
N$21
  Bottom 0.813: IC1.7 R18.2 93.34,5.4 95.33,7.38 95.33,18.73 R20.1
N$24  (via drill 2.79 pad 3.81)
  other vias: 3.17,3.17
N$26  (via drill 2.79 pad 3.81)
  other vias: 111.12,3.17
N$27
  Bottom 0.813: R22.2 THERMO.A
N$28
  Bottom 0.813: R31.E 20.95,80.01 24.73,76.24 L1.1
PB1  (1 unrouted)
  Bottom 0.813: R6.1 14.61,44.13 14.61,33.07 PB1(D4).1 24.5,33.07 27.3,35.88 27.3,45.72 ARDUINO_NANO2.22
PB2  (1 unrouted)
  Bottom 0.813: PB2(D7).2 6.45,8.41 10.11,12.06 10.11,17.83 R5.1 8.89,24.13 42.55,24.13 42.55,38.1 ARDUINO_NANO2.25
PWM-CT
  Bottom 0.813: R12.2 53.34,31.75 52.07,33.02 ARDUINO_NANO2.27
RC-A0
  Bottom 0.813: 62.55,22.86 63.5,22.86 | C18.1 72.07,26.35 68.58,22.86 63.5,22.86 | 62.55,22.86 62.55,23.81 | 62.55,22.86 62.23,22.86 59.69,20.32 R28.1 | 63.5,22.86 62.55,23.81 | 62.55,23.81 61.91,24.45 61.91,31.43 63.5,33.02 ARDUINO_NANO2.4
RC-INP
  Bottom 0.813: R28.2 58.42,24.13 57.83,23.54 45.04,23.54 43.81,24.77 43.81,35.56 ARDUINO_NANO2.26 52.39,35.56 53.66,36.83 53.66,71.44 R29.2
RLC-A7
  Bottom 0.813: L1.2 27.94,81.24 26.35,82.83 C19.1 28.89,88.9 | D5.A 30.48,88.9 28.89,88.9 | 28.89,88.9 29.21,89.22 D6.C 28.89,96.52 26.99,98.42 26.99,105.41 28.26,106.68 54.93,106.68 57.15,104.46 57.15,39.05 58.1,38.1 58.4,38.28 59.79,38.28 60.91,39.4 60.91,47.5 63.98,50.57 64.54,50.57 ARDUINO_NANO2.11
TRIG  (via drill 0.64 pad 1.78)  (1 unrouted)
  Top 0.813: v75.88,60.33 v75.88,36.2
  Bottom 0.813: v75.88,36.2 69.22,36.2 68.58,35.56 68.58,25.4 ARDUINO_NANO2.1 | U$2.2 58.42,120.65 59.34,121.57 76.55,121.57 78.11,120.02 78.11,88.9 74.3,85.09 74.3,66.67 75.88,65.09 v75.88,60.33
VOLTAGE-A1
  Bottom 0.813: R18.1 70.8,5.4 C10.1 66.67,1.91 17.14,1.91 12.06,6.99 12.06,21.59 13.28,22.81 34.8,22.81 35.38,22.23 59.05,22.23 60.33,23.5 60.33,33.02 62.87,35.56 ARDUINO_NANO2.5

### Text on the board
Bottom: PHYSICS WITH / ARDUINO
tNames: GND | +5V | SCK | CS | SO | GND | +5V | SCK | CS-2 | SO | THERMO | RGB | RLC | DIODE / TRACER